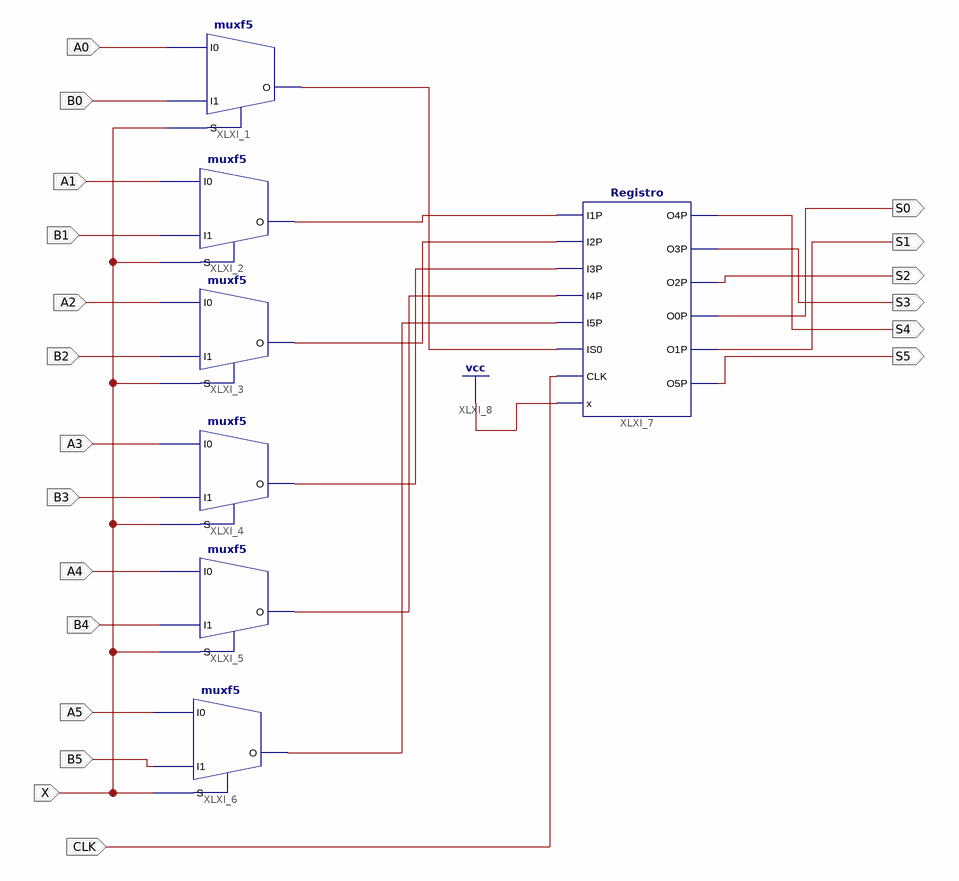
[diagram p0: schematic sheet 1]
// Xilinx ISE schematic RegistroA.sch (spartan3e) as structural Verilog: 7 symbols, 20 ports
module RegistroA (
  input  X,
  input  CLK,
  input  A0,
  input  B0,
  input  A1,
  input  B1,
  input  A2,
  input  B2,
  input  A3,
  input  B3,
  input  A4,
  input  B4,
  input  A5,
  input  B5,
  output S4,
  output S3,
  output S2,
  output S0,
  output S1,
  output S5
);

  wire XLXN_1, XLXN_2, XLXN_3, XLXN_4, XLXN_5, XLXN_6;

  muxf5 XLXI_1 (.I0(A0), .I1(B0), .S(X), .O(XLXN_1));
  muxf5 XLXI_2 (.I0(A1), .I1(B1), .S(X), .O(XLXN_2));
  muxf5 XLXI_3 (.I0(A2), .I1(B2), .S(X), .O(XLXN_3));
  muxf5 XLXI_4 (.I0(A3), .I1(B3), .S(X), .O(XLXN_4));
  muxf5 XLXI_5 (.I0(A4), .I1(B4), .S(X), .O(XLXN_5));
  muxf5 XLXI_6 (.I0(A5), .I1(B5), .S(X), .O(XLXN_6));
  Registro XLXI_7 (
    .I1P(XLXN_2), .I2P(XLXN_3), .I3P(XLXN_4), .I4P(XLXN_5), .I5P(XLXN_6), .IS0(XLXN_1), .CLK(CLK), .x(1'b1),
    .O4P(S4), .O3P(S3), .O2P(S2), .O0P(S0), .O1P(S1), .O5P(S5));
endmodule
